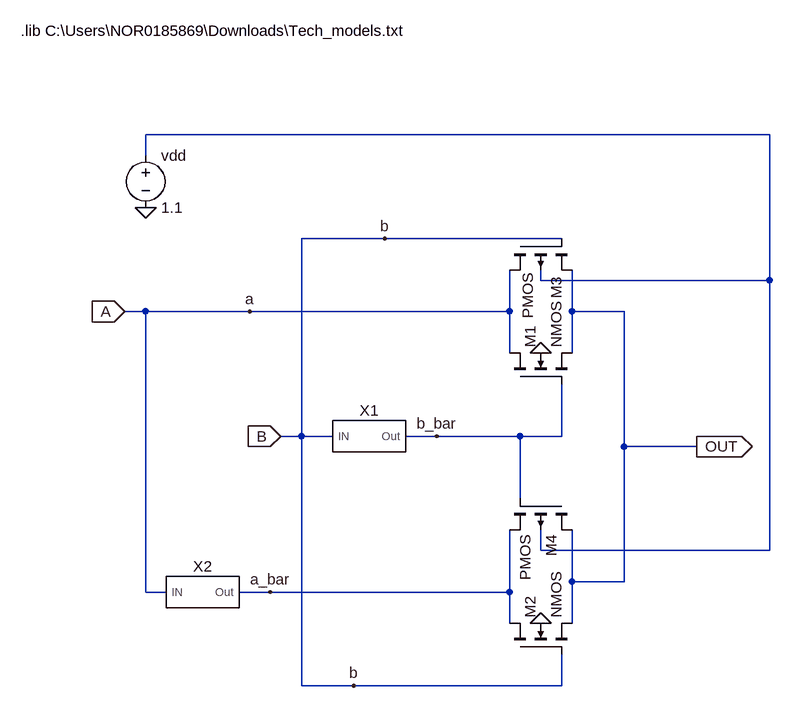
[diagram p0: schematic Bitwise_XOR.asc]
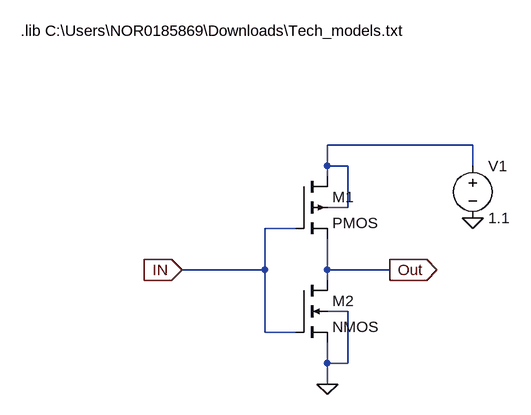
[diagram p1: sub-circuit inverter.asc]
Bitwise_XOR.asc, the LTspice schematic file:
Version 4
SHEET 1 880 716
WIRE 544 -176 -416 -176
WIRE -416 -144 -416 -176
WIRE -48 -16 -176 -16
WIRE 224 -16 -48 -16
WIRE 192 48 192 32
WIRE 544 48 544 -176
WIRE 544 48 192 48
WIRE -416 96 -448 96
WIRE -256 96 -416 96
WIRE 144 96 144 32
WIRE 144 96 -256 96
WIRE 240 96 240 32
WIRE 320 96 240 96
WIRE 144 160 144 96
WIRE 240 160 240 96
WIRE -176 288 -176 -16
WIRE -176 288 -208 288
WIRE -128 288 -176 288
WIRE 32 288 -16 288
WIRE 160 288 32 288
WIRE 224 288 224 208
WIRE 224 288 160 288
WIRE 320 304 320 96
WIRE 432 304 320 304
WIRE 160 384 160 288
WIRE 192 464 192 432
WIRE 544 464 544 48
WIRE 544 464 192 464
WIRE 240 512 240 432
WIRE 320 512 320 304
WIRE 320 512 240 512
WIRE -416 528 -416 96
WIRE -384 528 -416 528
WIRE -224 528 -272 528
WIRE 144 528 144 432
WIRE 144 528 -224 528
WIRE 144 576 144 528
WIRE 240 576 240 512
WIRE -176 672 -176 288
WIRE -96 672 -176 672
WIRE 224 672 224 624
WIRE 224 672 -96 672
FLAG 192 576 0
FLAG 192 160 0
FLAG -416 -64 0
FLAG -256 96 a
FLAG -224 528 a_bar
FLAG -48 -16 b
FLAG 32 288 b_bar
FLAG -96 672 b
FLAG -448 96 A
IOPIN -448 96 In
FLAG -208 288 B
IOPIN -208 288 In
FLAG 432 304 OUT
IOPIN 432 304 Out
SYMBOL nmos4 144 208 R270
SYMATTR InstName M1
SYMATTR Value2 l=32n w=64n
SYMBOL nmos4 144 624 R270
SYMATTR InstName M2
SYMATTR Value2 l=32n w=64n
SYMBOL pmos4 144 -16 M90
WINDOW 0 59 72 Left 2
WINDOW 3 53 28 Left 2
SYMATTR InstName M3
SYMATTR Value2 l=32n w=128n
SYMBOL pmos4 240 384 R90
SYMATTR InstName M4
SYMATTR Value2 l=32n w=128n
SYMBOL voltage -416 -160 R0
WINDOW 123 0 0 Left 0
WINDOW 39 0 0 Left 0
SYMATTR InstName vdd
SYMATTR Value 1.1
SYMBOL inverter -80 288 R0
SYMATTR InstName X1
SYMBOL inverter -336 528 R0
SYMATTR InstName X2
TEXT -608 -336 Left 2 !.lib C:\\Users\\NOR0185869\\Downloads\\Tech_models.txt

inverter.asc, the sub-circuit schematic file:
Version 4
SHEET 1 880 680
WIRE 560 144 336 144
WIRE 336 176 336 144
WIRE 368 176 336 176
WIRE 560 176 560 144
WIRE 336 192 336 176
WIRE 368 240 368 176
WIRE 368 240 336 240
WIRE 288 272 240 272
WIRE 240 336 240 272
WIRE 240 336 112 336
WIRE 336 336 336 288
WIRE 432 336 336 336
WIRE 336 352 336 336
WIRE 368 400 336 400
WIRE 240 432 240 336
WIRE 288 432 240 432
WIRE 336 480 336 448
WIRE 368 480 368 400
WIRE 368 480 336 480
WIRE 336 512 336 480
FLAG 560 256 0
FLAG 336 512 0
FLAG 112 336 IN
IOPIN 112 336 In
FLAG 432 336 Out
IOPIN 432 336 Out
SYMBOL pmos4 288 192 R0
SYMATTR InstName M1
SYMATTR Value2 l=32n w=64n
SYMBOL nmos4 288 352 R0
SYMATTR InstName M2
SYMATTR Value2 l=32n w=64n
SYMBOL voltage 560 160 R0
WINDOW 123 0 0 Left 0
WINDOW 39 0 0 Left 0
SYMATTR InstName V1
SYMATTR Value 1.1
TEXT -136 -32 Left 2 !.lib C:\\Users\\NOR0185869\\Downloads\\Tech_models.txt

The netlist it stands for:
* Bitwise_XOR.asc
M1 a b_bar OUT 0 NMOS l=32n w=64n
M2 a_bar b OUT 0 NMOS l=32n w=64n
M3 a b OUT N001 PMOS l=32n w=128n
M4 OUT b_bar a_bar N001 PMOS l=32n w=128n
vdd N001 0 1.1
XX1 b b_bar inverter
XX2 a a_bar inverter

* block symbol definitions
.subckt inverter IN Out
M1 N001 IN Out N001 PMOS l=32n w=64n
M2 Out IN 0 0 NMOS l=32n w=64n
V1 N001 0 1.1
.lib C:\Users\NOR0185869\Downloads\Tech_models.txt
.ends inverter

.model NMOS NMOS
.model PMOS PMOS
.lib standard.mos
.lib C:\Users\NOR0185869\Downloads\Tech_models.txt
.backanno
.end